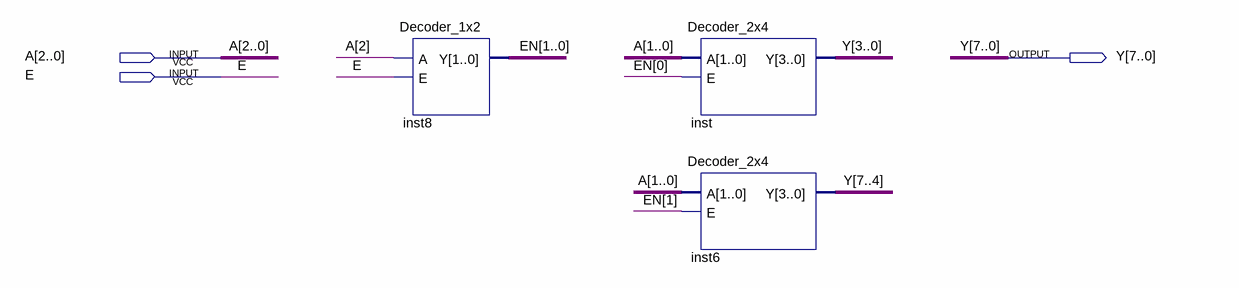
[diagram p0: schematic sheet]
// Quartus schematic Decoder_3x8.bdf as structural Verilog: 3 symbols, 3 pins
module Decoder_3x8 (
  input  [2:0] A,
  input  E,
  output [7:0] Y
);

  wire [1:0] EN;

  Decoder_1x2 inst8 (.A(A[2]), .E(E), .Y(EN));
  Decoder_2x4 inst (.A(A[1:0]), .E(EN[0]), .Y(Y[3:0]));
  Decoder_2x4 inst6 (.A(A[1:0]), .E(EN[1]), .Y(Y[7:4]));
endmodule
